# Altium schematic sheet sch_AGV_Power.SchDoc
size A; SheetNumber: 1; SheetTotal: 6
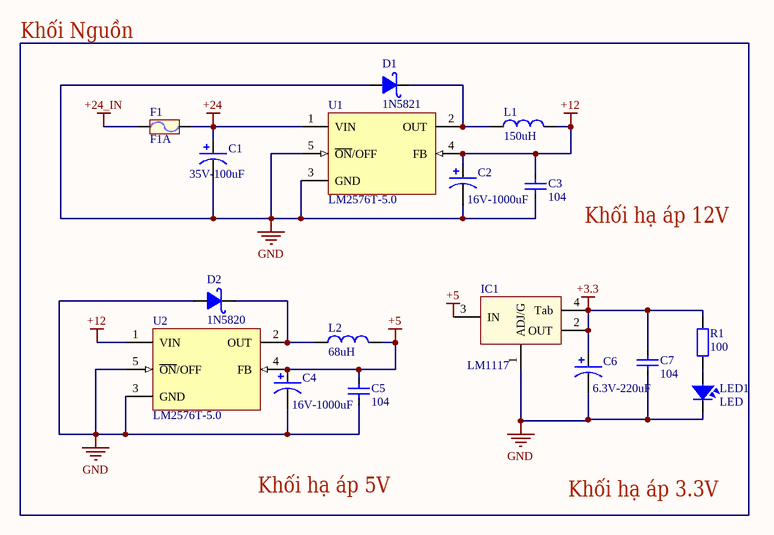
[diagram p0: sch_AGV_Power.SchDoc]

## Parts
C1  35V-100uF  [CAP_D6.3]
C2  16V-1000uF  [CAP_D10]
C3  104  [CAP_0805]
C4  16V-1000uF  [CAP_D10]
C5  104  [CAP_0805]
C6  6.3V-220uF  [CAP_D10]
C7  104  [CAP_0805]
D1  1N5821  [SMA]
D2  1N5820  [SMA]
F1  F1A  [FUSE]
IC1  LM1117  [SOT223-4N]
L1  150uH  [L-SMD-M-12x10]
L2  68uH  [L-SMD-M-12x10]
LED1  LED  [LED_BLUE_SMD_0805]
R1  100  [RES_SMD_0805]
U1  LM2576T-5.0  [TO-263]
U2  LM2576T-5.0  [TO-263]

## Nets
+3.3: C6.1 C7.2 IC1.2(OUT) IC1.4(Tab) R1.1
+5: C4.1 C5.2 IC1.3(IN) L2.2 U2.4(FB)
+12: C2.1 C3.2 L1.2 U1.4(FB) U2.1(VIN)
+24: C1.1 F1.1 U1.1(VIN)
+24_IN: F1.2
GND: C1.2 C2.2 C3.1 C4.2 C5.1 C6.2 C7.1 D1.1(A) D2.1(A) IC1.1(ADJ/G) LED1.2 U1.3(GND) U1.5(~{ON}/OFF) U2.3(GND) U2.5(~{ON}/OFF)
NetD1_2: D1.2(K) L1.1 U1.2(OUT)
NetD2_2: D2.2(K) L2.1 U2.2(OUT)
NetLED1_1: LED1.1 R1.2

## Notes on the sheet
- Khối Nguồn
- (near C3) Khối hạ áp 12V
- Khối hạ áp 5V
- Khối hạ áp 3.3V

## Library data of the parts
C1 C2 C4 C6 = CapPol: Polarized Capacitor (Axial); Published: 8-Jun-2000; LatestRevisionDate: 17-Jul-2002; LatestRevisionNote: Re-released for DXP Platform.; PackageReference: POLAR0.8; Publisher: Altium Limited
C3 C5 C7 = CapSMD: Capacitor; Value: 33p; Published: 8-Jun-2000; LatestRevisionDate: 17-Jul-2002; LatestRevisionNote: Re-released for DXP Platform.; PackageReference: RAD-0.3; Publisher: Altium Limited
D1 D2 = 1N5822: Schottky Rectifiers; Value: Diode c?m 1N5408
F1 = Fuse: Designed by: VanDungEvn; Value: Fuse
IC1 = LM1117: 3v3; Value: LM317
L1 L2 = Inductor: Value: 150 mH
LED1 = LED: LED Single colour Green and Red; Value: LED 3 ly Single Colour
R1 = Res: Resistor; Manufacturer: Generic Components; Class: Passive; Published: 08/06/2000; Publisher: Altium Hobart Technology Centre
U1 U2 = LM2576T-5.0: SIMPLE SWITCHER; 3A Step-Down Voltage Regulator; Manufacturer: National Semiconductor; PackageTopMarking: NSUZXYTT*LM2576T*-5.0 P+; PowerWise: N; FirstPublished: 4-Dec-2008; DatasheetVersion: Aug-2004; PackageVersion: revJ, Jan-1992; PackageReference: T05A; Publisher: Altium Limited; PackageDescription: TO-220, Molded, 5 Lead, Straight; CompType: Switcher; PartNumber: LM2576T-5.0; RoHS: O; PinCount: 5; DigiKeyPartNumber: LM2576T-5.0-ND; Code_JEDEC: TO-220-AB; ComponentLink1Description: LM2576 Datasheet; ComponentLink1URL: http://www.national.com/ds/LM/LM2576.pdf; ComponentLink2Description: LM2576 Web Page; ComponentLink2URL: http://www.national.com/pf/LM/LM2576.html; ComponentLink3Description: T05A Package Page; ComponentLink3URL: http://www.national.com/packaging/folders/t05a.html